# EasyEDA Pro project ProPrj_4进4出_2026-07-01.epro, schematic Schematic1

## Sheets
1 P1: Assembly Variant: Basic; Board Name: Board1; Create Date: 2026-05-13; Page Name: P1; Project Name: 4进4出; Schematic Name: Schematic1; Update Date: 2026-05-13; Company: 嘉立创EDA; Page Size: A4; Version: V1.0
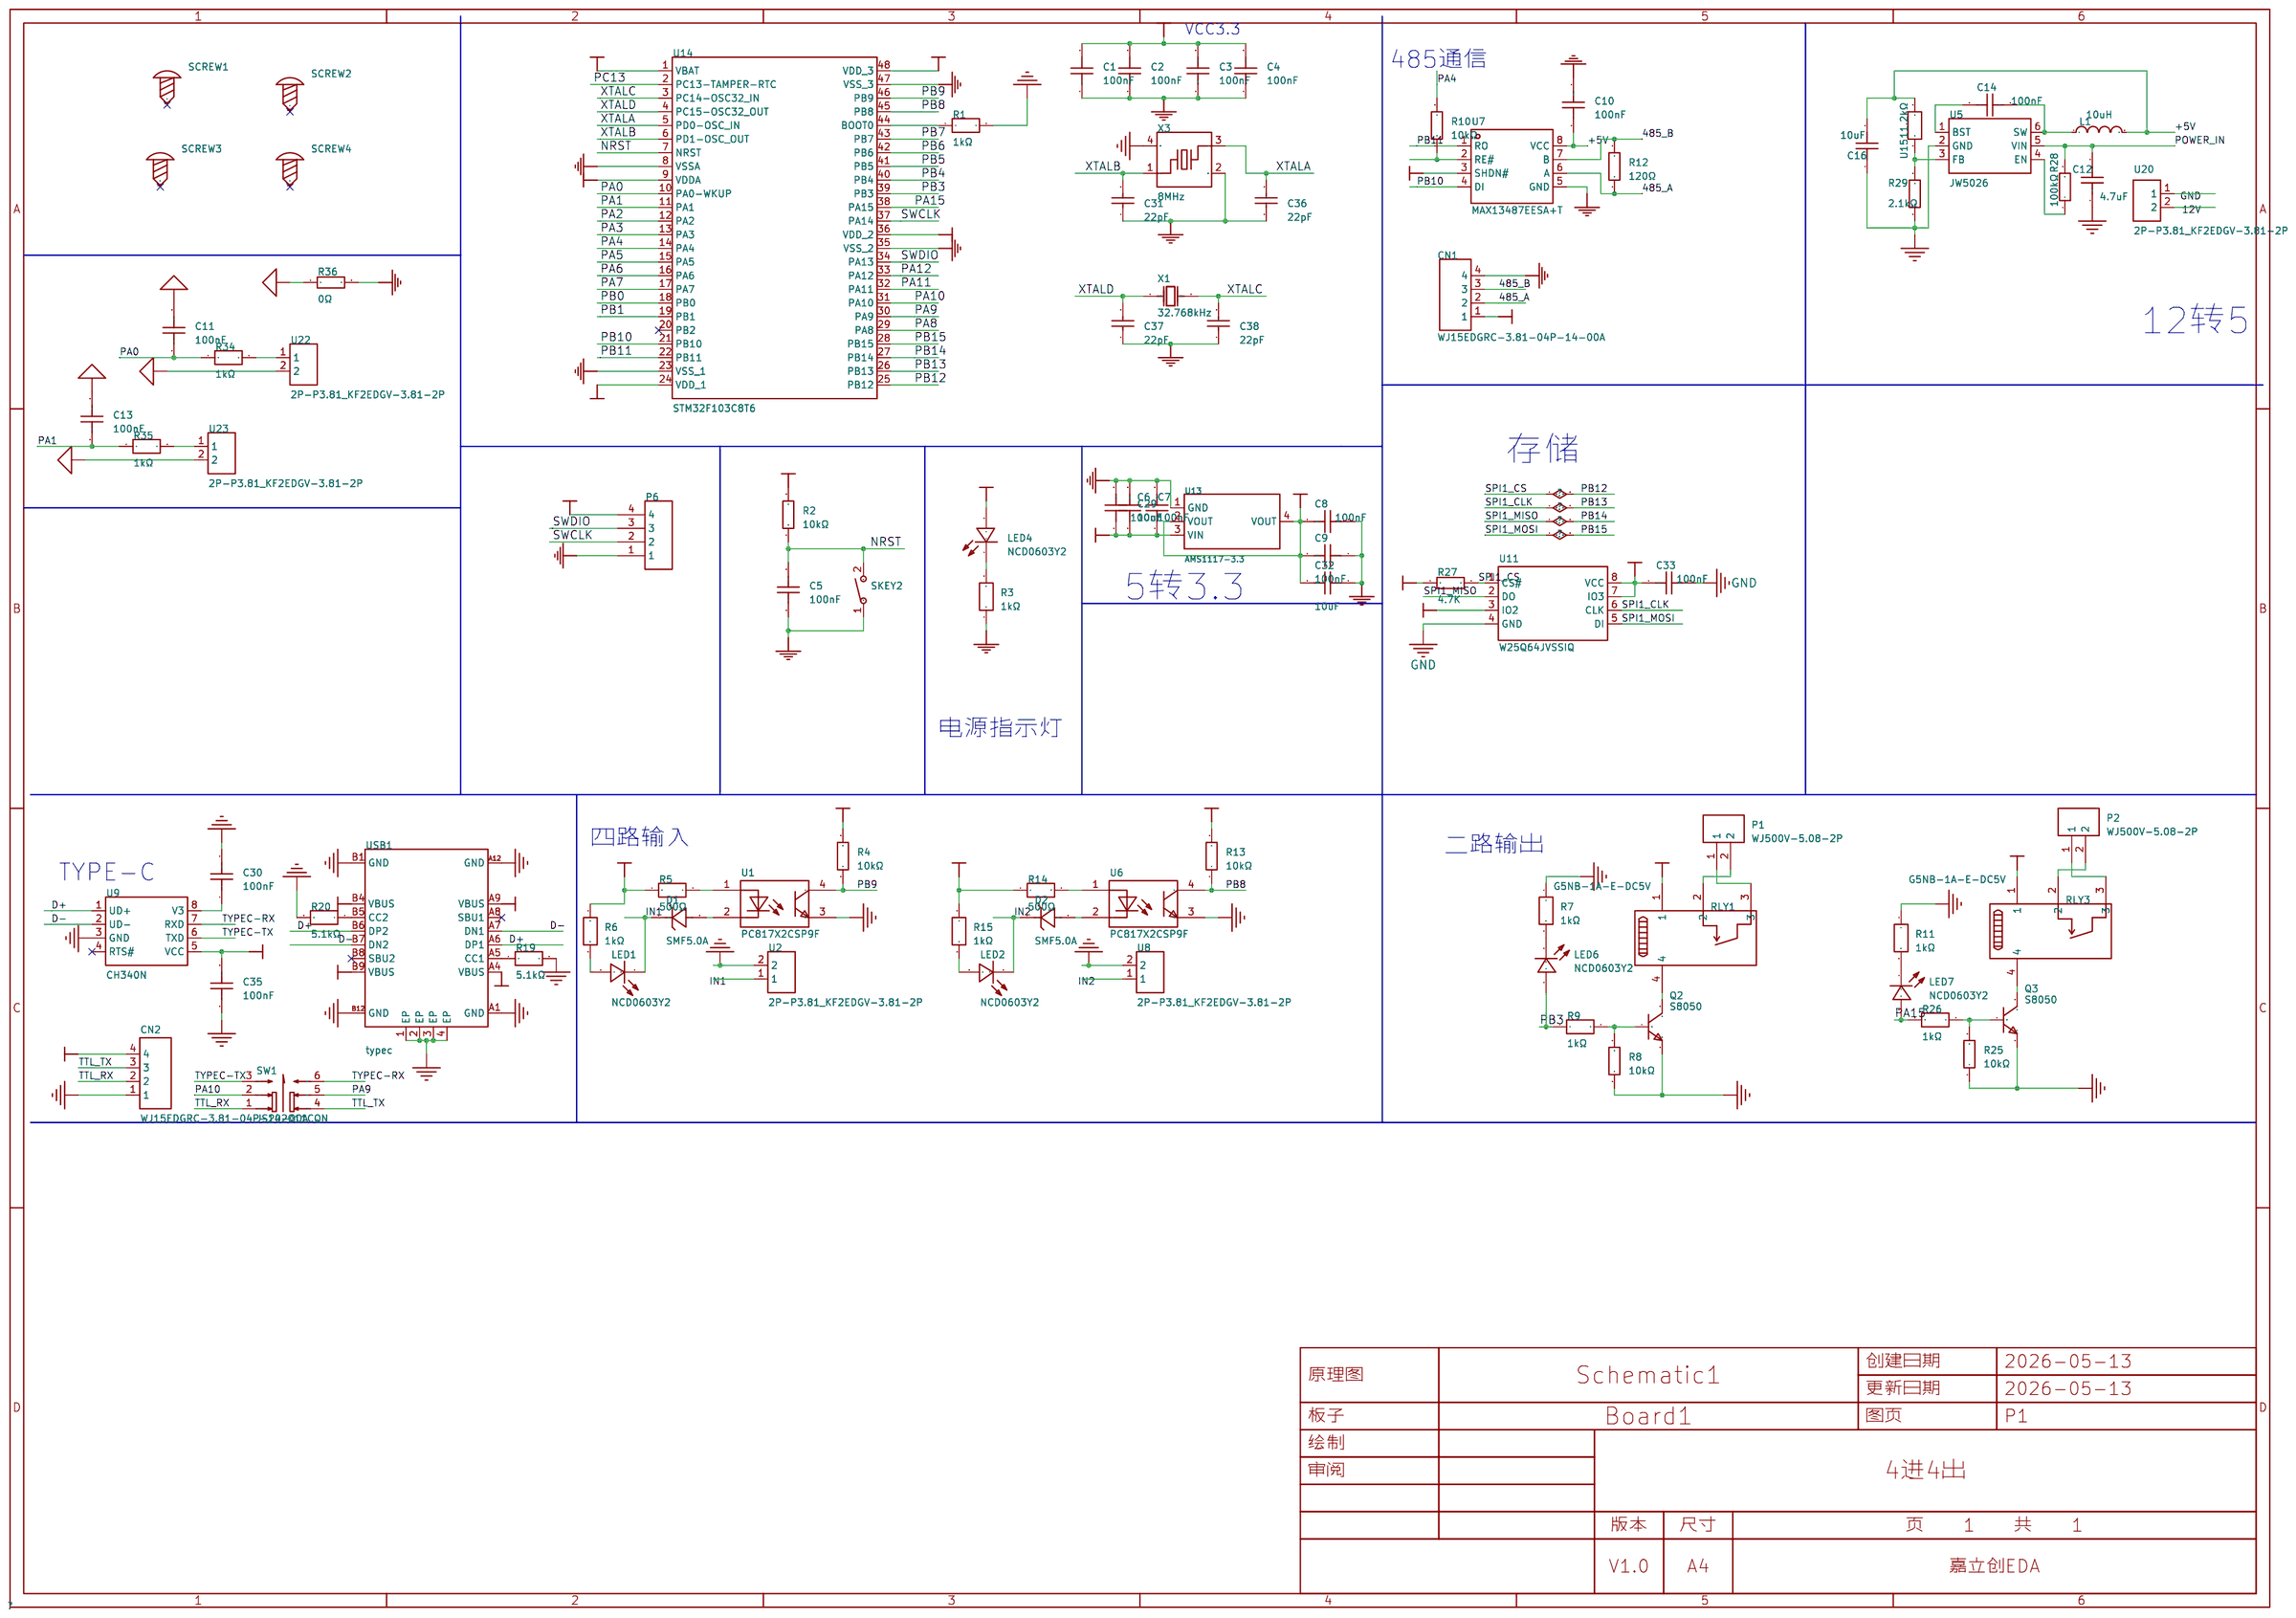
[diagram p0: P1]
2 W5500: Create Date: 2026-06-04; Page Name: P2; Update Date: 2026-06-04
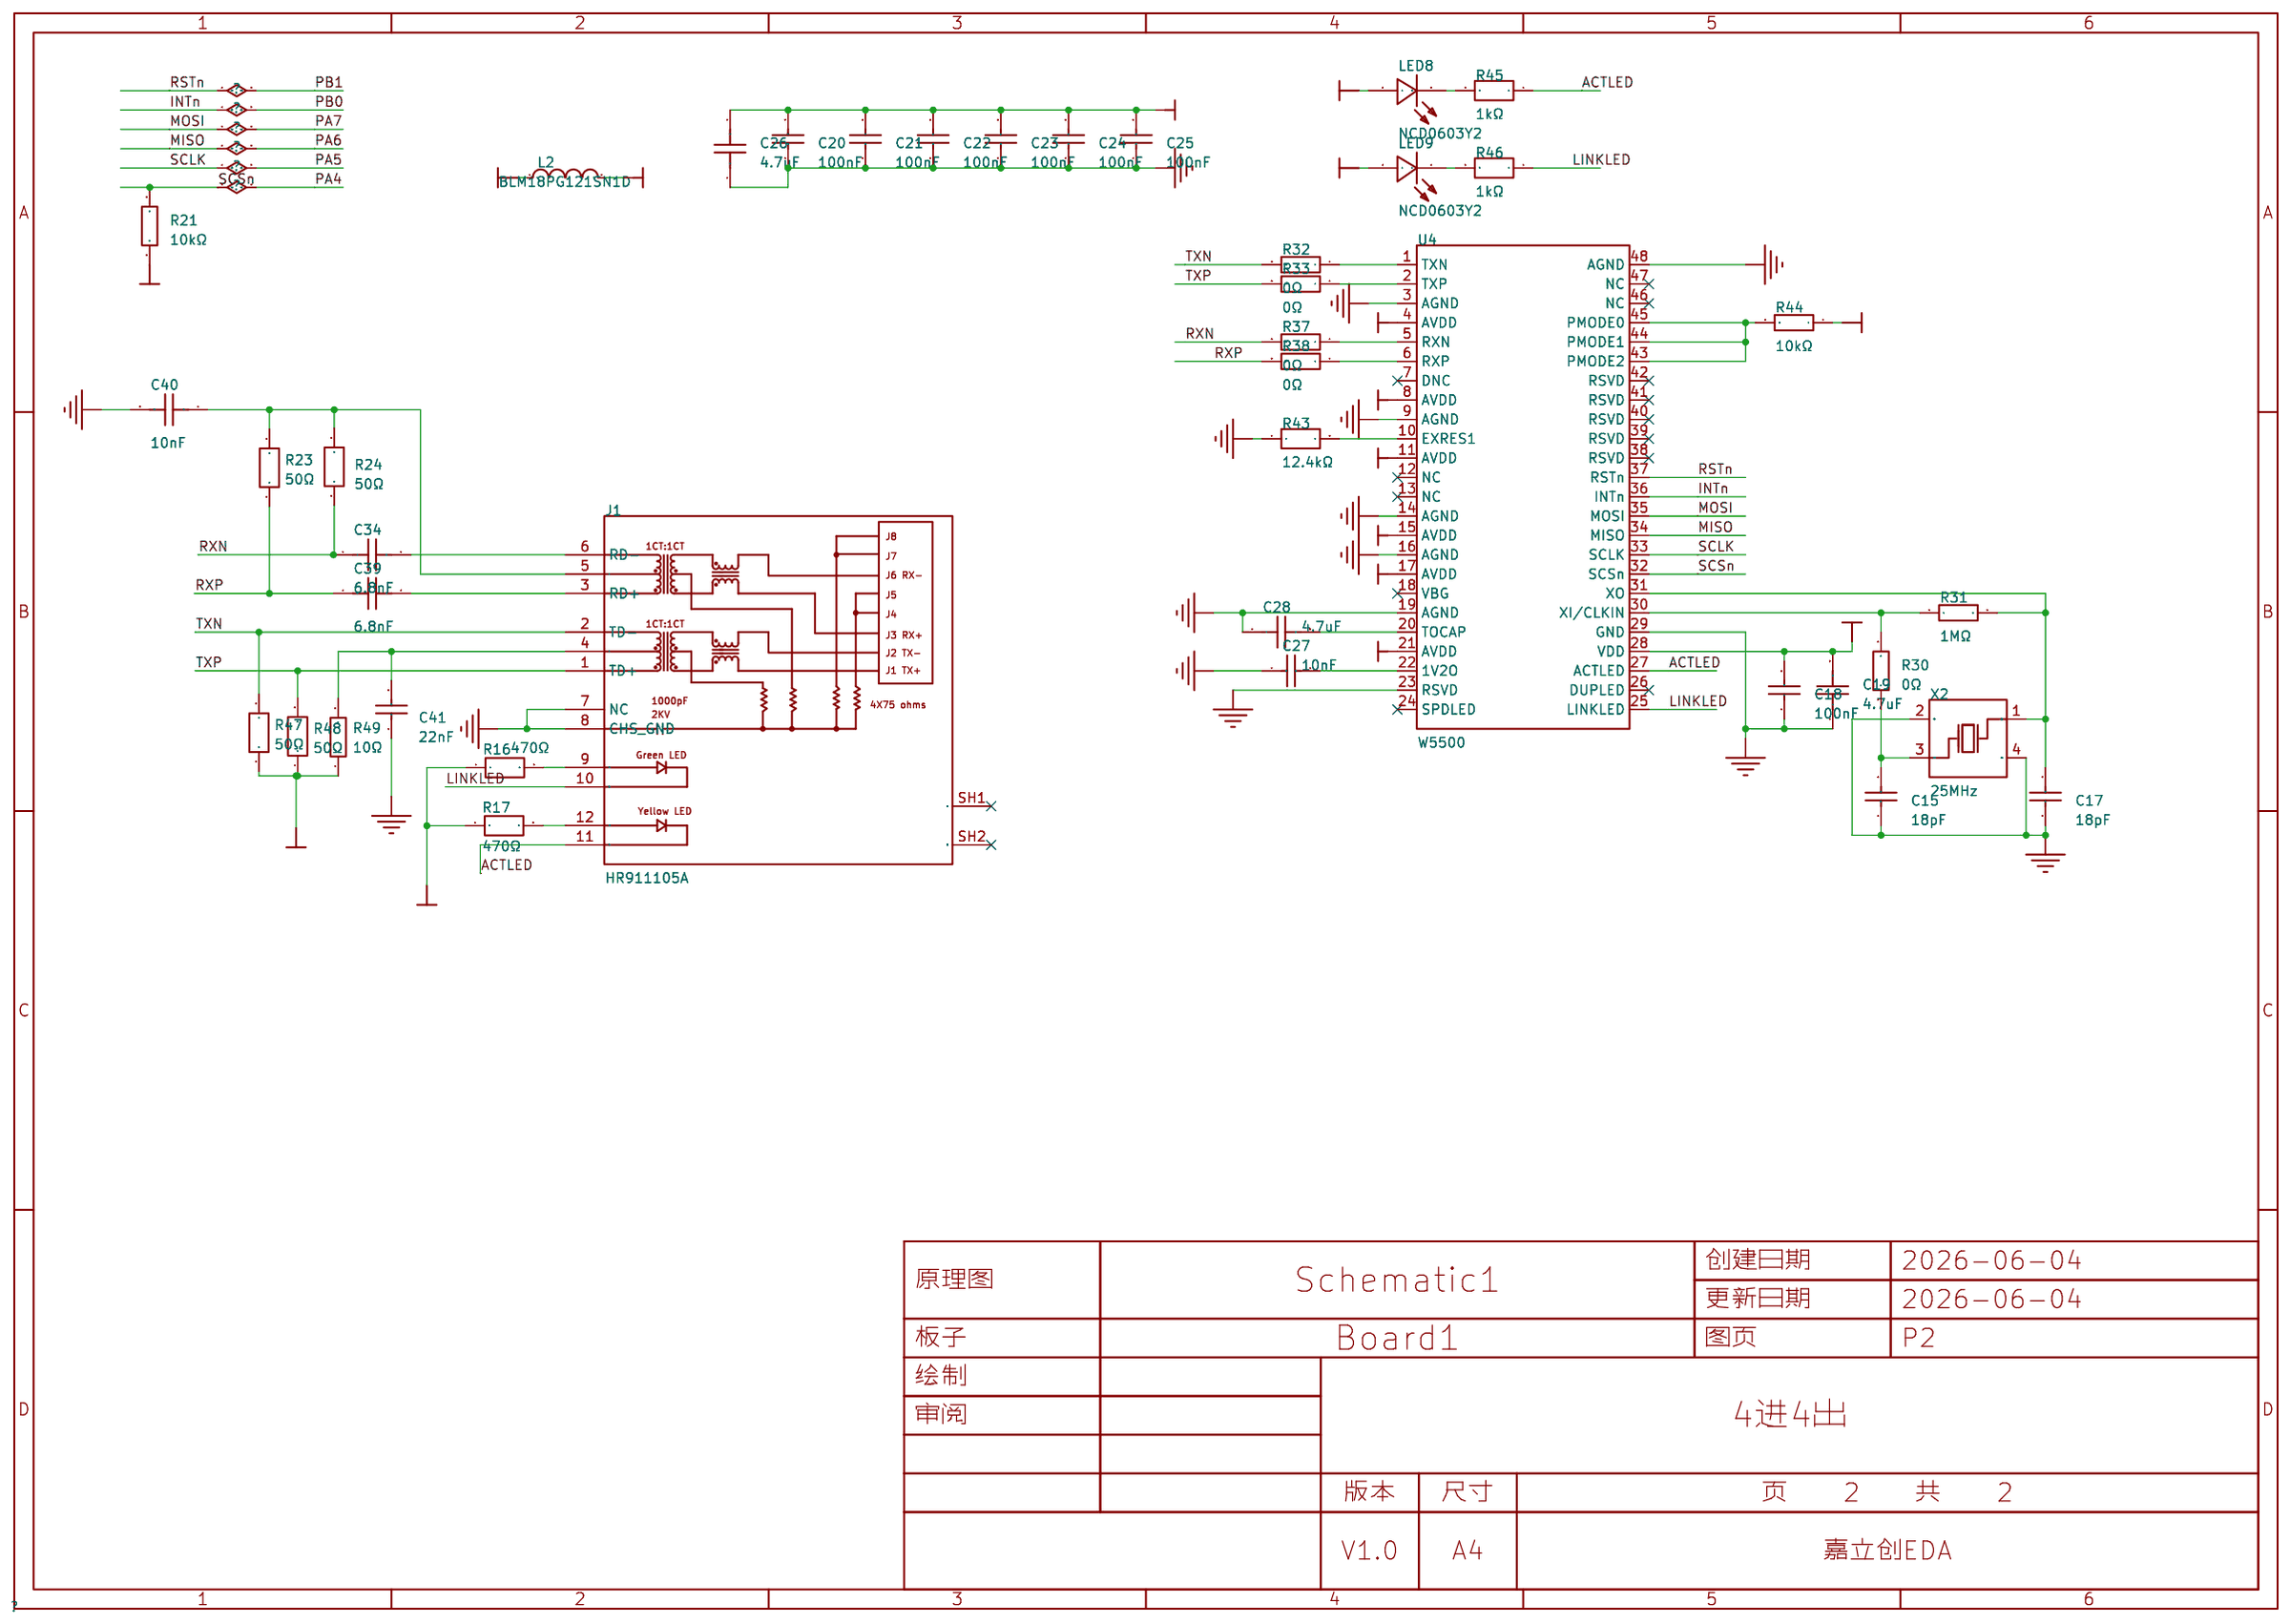
[diagram p1: W5500]
3 IIC: Create Date: 2026-06-18; Page Name: P2; Update Date: 2026-06-18
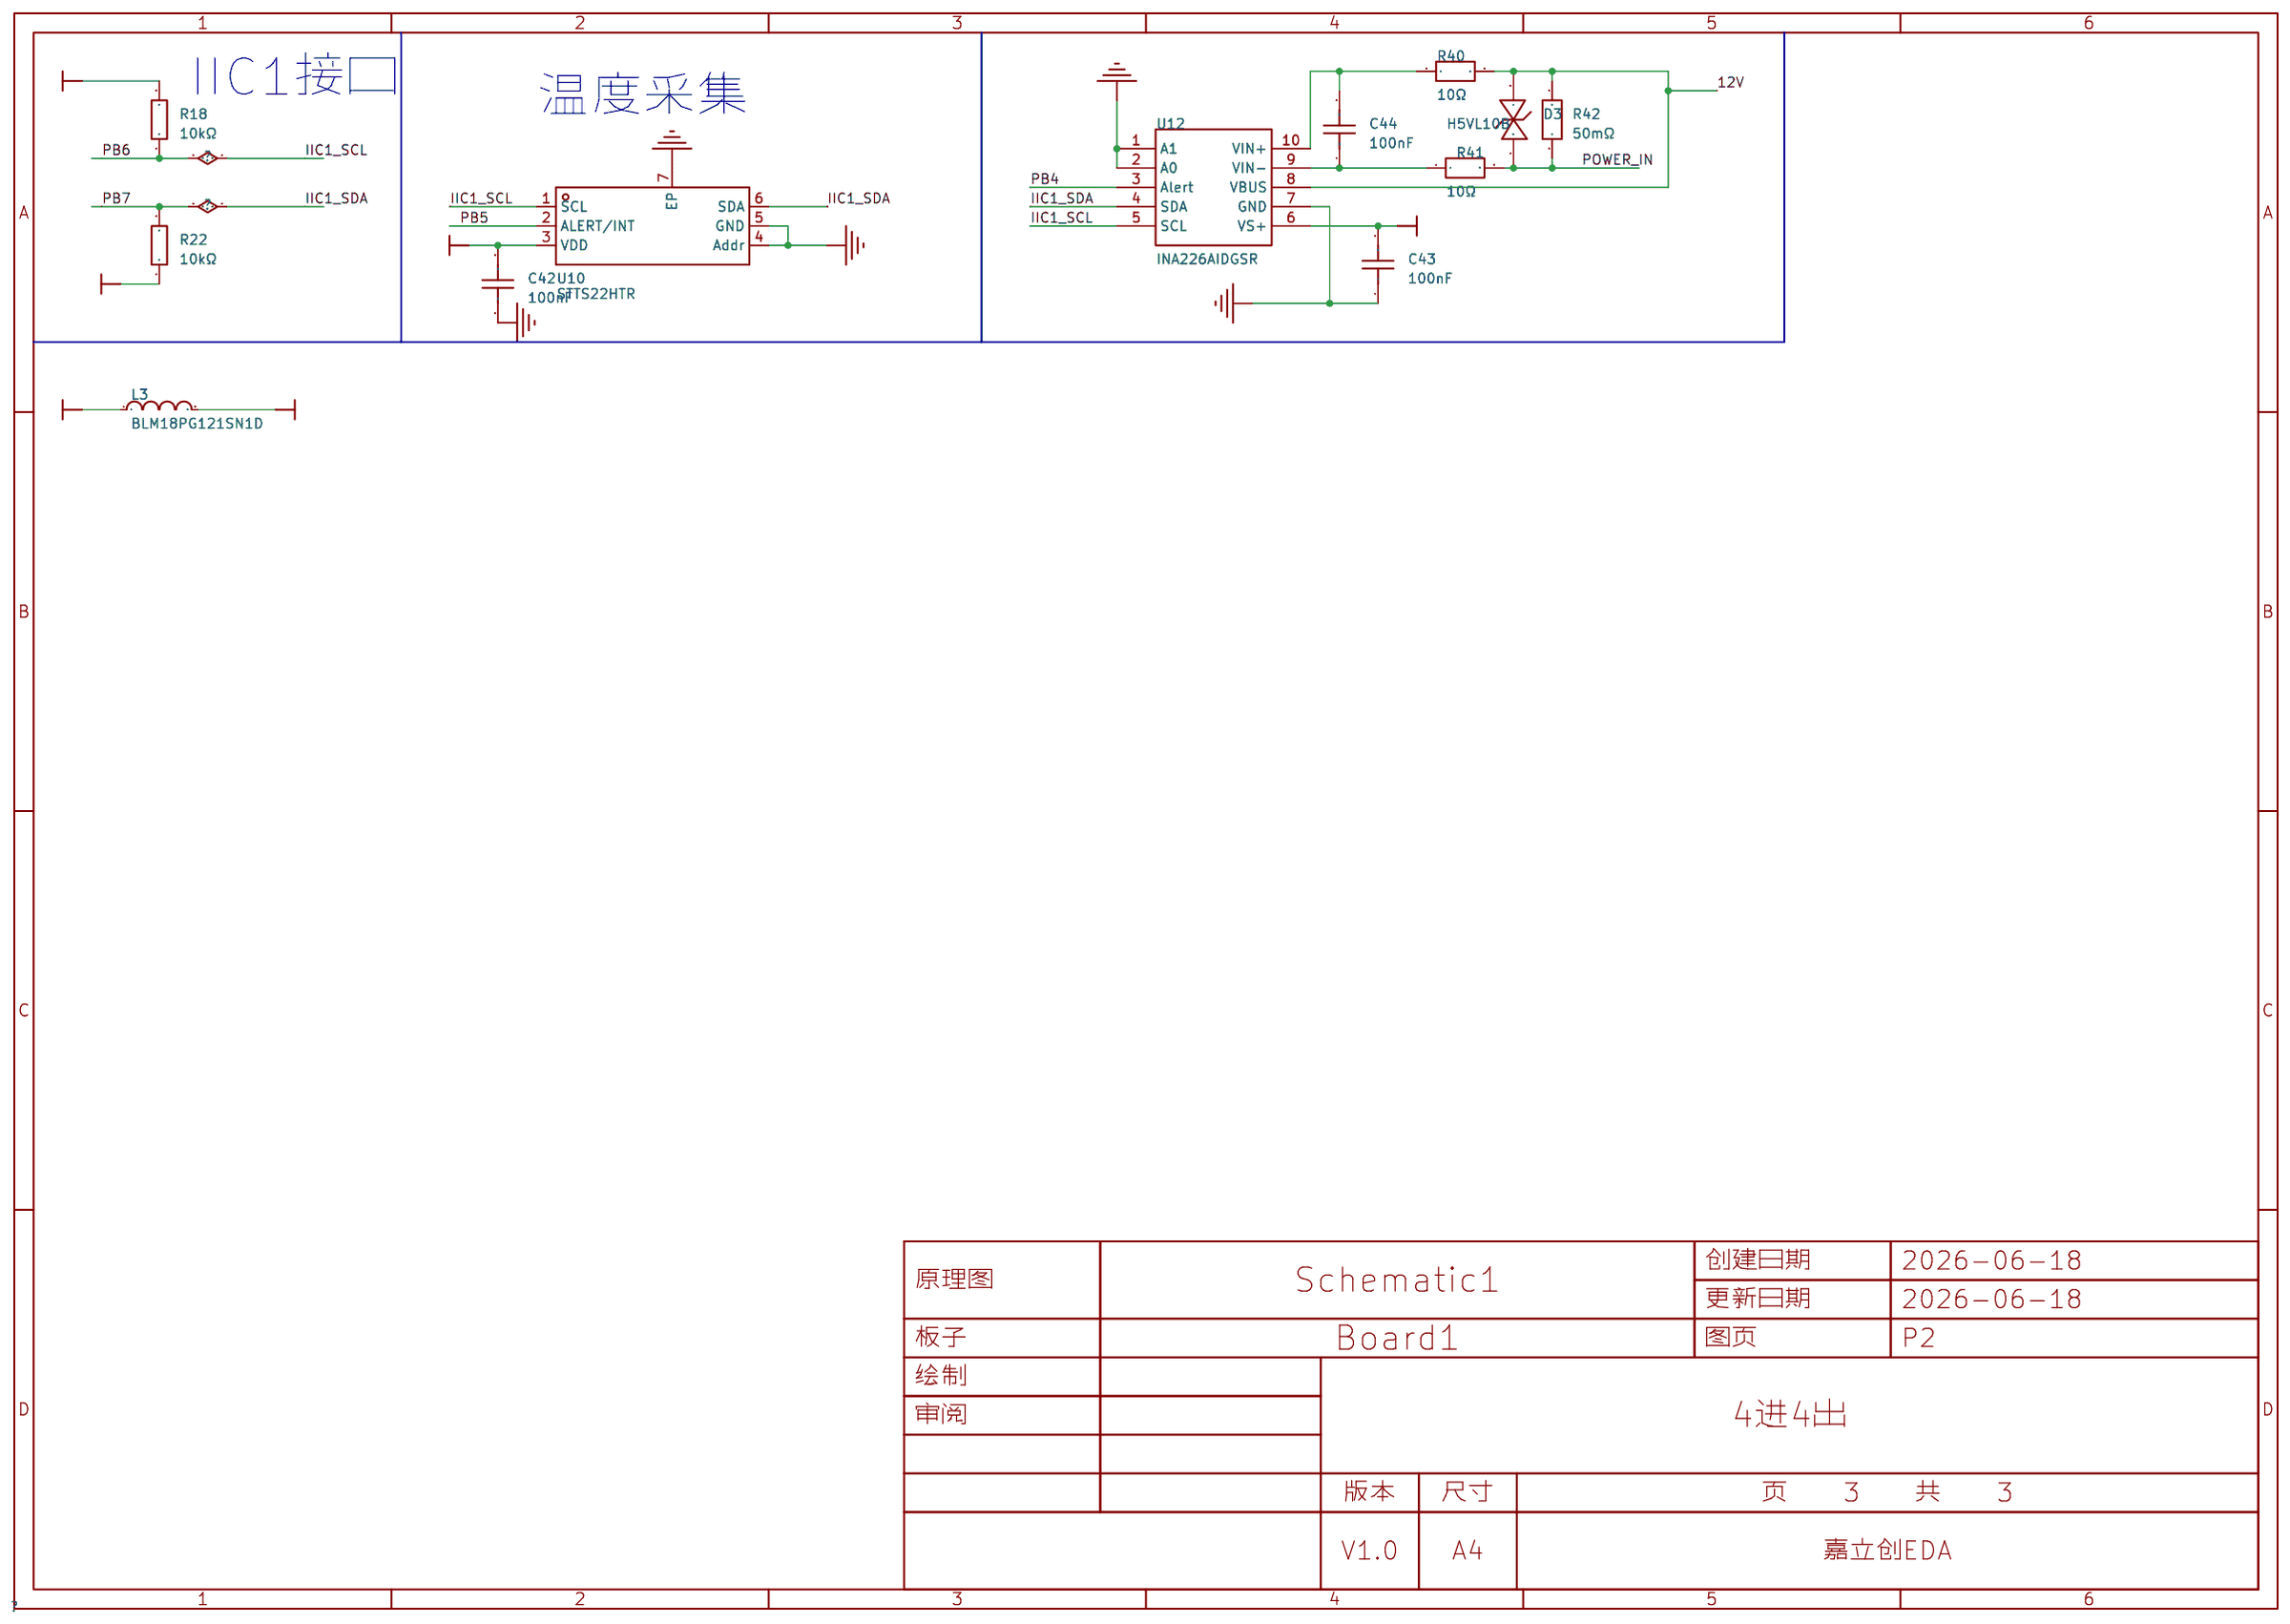
[diagram p2: IIC]

## Parts
sheet IIC
C42  100nF  [C0603]
C43  100nF  [C0603]
C44  100nF  [C0603]
D3  H5VL10B  [SOD-882_L1.0-W0.6-BI]
L3  BLM18PG121SN1D  [L0603]
R18  10kΩ  [R0603]
R22  10kΩ  [R0603]
R40  10Ω  [R0603]
R41  10Ω  [R0603]
R42  50mΩ  [R0603]
U10  STTS22HTR  [DFN-6_L2.0-W2.0-P0.65-BL-EP1.2]
U12  INA226AIDGSR  [MSOP-10_L3.0-W3.0-P0.50-LS5.0-BL]
sheet P1
C1  100nF  [C0603]
C2  100nF  [C0603]
C3  100nF  [C0603]
C4  100nF  [C0603]
C5  100nF  [C0603]
C6  100nF  [C0603]
C7  100nF  [C0603]
C8  100nF  [C0603]
C9  100nF  [C0603]
C10  100nF  [C0603]
C11  100nF  [C0603]
C12  4.7uF  [C0603]
C13  100nF  [C0603]
C14  100nF  [C0603]
C16  10uF  [C0603]
C29  10uF  [C0603]
C30  100nF  [C0603]
C31  22pF  [C0603]
C32  10uF  [C0603]
C33  100nF  [C0603]
C35  100nF  [C0603]
C36  22pF  [C0603]
C37  22pF  [C0603]
C38  22pF  [C0603]
CN1  WJ15EDGRC-3.81-04P-14-00A  [CONN-TH_WJ15EDGRC-3.81-4P]
CN2  WJ15EDGRC-3.81-04P-14-00A  [CONN-TH_WJ15EDGRC-3.81-4P]
D1  SMF5.0A  [SOD-123FL_L2.7-W1.8-LS3.8-RD]
D2  SMF5.0A  [SOD-123FL_L2.7-W1.8-LS3.8-RD]
L1  10uH  [IND-SMD_L7.3-W6.8]
LED1  NCD0603Y2  [LED0603-RD]
LED2  NCD0603Y2  [LED0603-RD]
LED4  NCD0603Y2  [LED0603-RD]
LED6  NCD0603Y2  [LED0603-RD]
LED7  NCD0603Y2  [LED0603-RD]
P1  WJ500V-5.08-2P  [CONN-TH_2P-P5.00_WJ500V-5.08-2P]
P2  WJ500V-5.08-2P  [CONN-TH_2P-P5.00_WJ500V-5.08-2P]
P6  4Pin  [4Pin-2.54]
Q2  S8050  [SOT-23-3_L2.9-W1.3-P1.90-LS2.3-BR]
Q3  S8050  [SOT-23-3_L2.9-W1.3-P1.90-LS2.3-BR]
R1  1kΩ  [R0603]
R2  10kΩ  [R0603]
R3  1kΩ  [R0603]
R4  10kΩ  [R0603]
R5  500Ω  [R0603]
R6  1kΩ  [R0603]
R7  1kΩ  [R0603]
R8  10kΩ  [R0603]
R9  1kΩ  [R0603]
R10  10kΩ  [R0603]
R11  1kΩ  [R0603]
R12  120Ω  [R0603]
R13  10kΩ  [R0603]
R14  500Ω  [R0603]
R15  1kΩ  [R0603]
R19  5.1kΩ  [R0603]
R20  5.1kΩ  [R0603]
R25  10kΩ  [R0603]
R26  1kΩ  [R0603]
R27  4.7K  [R0603_1]
R28  100kΩ  [R0603]
R29  2.1kΩ  [R0603]
R34  1kΩ  [R0603]
R35  1kΩ  [R0603]
R36  0Ω  [R0603]
RLY1  G5NB-1A-E-DC5V  [RELAY-TH_G5NB-1A-E-DCXX]
RLY3  G5NB-1A-E-DC5V  [RELAY-TH_G5NB-1A-E-DCXX]
SCREW1  -  [M2螺丝]
SCREW2  -  [M2螺丝]
SCREW3  -  [M2螺丝]
SCREW4  -  [M2螺丝]
SKEY2  TS-1185-B-A-B-A  [SW-SMD_L4.0-W3.0-LS5.0]
SW1  JS202011CQN  [SW-TH_JS202011CQN]
U1  PC817X2CSP9F  [SMD-4_L4.6-W6.5-P2.54-LS10.2-TL]
U2  2P-P3.81_KF2EDGV-3.81-2P  [CONN-TH_2P-P3.81_KF2EDGV-3.81-2P]
U5  JW5026  [SOT-23-6_L2.9-W1.6-P0.95-LS2.8-BR]
U6  PC817X2CSP9F  [SMD-4_L4.6-W6.5-P2.54-LS10.2-TL]
U7  MAX13487EESA+T  [SOIC-8_L4.9-W3.9-P1.27-LS6.0-BL]
U8  2P-P3.81_KF2EDGV-3.81-2P  [CONN-TH_2P-P3.81_KF2EDGV-3.81-2P]
U9  CH340N  [SOP-8_L4.9-W3.9-P1.27-LS6.0-BL]
U11  W25Q64JVSSIQ  [SOP-8_L5.3-W5.3-P1.27-LS8.0-BL]
U13  AMS1117-3.3  [SOT-223-3_L6.5-W3.4-P2.30-LS7.0-BR]
U14  STM32F103C8T6  [LQFP-48_L7.0-W7.0-P0.50-LS9.0-BL]
U15  11.2kΩ  [R0603]
U20  2P-P3.81_KF2EDGV-3.81-2P  [CONN-TH_2P-P3.81_KF2EDGV-3.81-2P]
U22  2P-P3.81_KF2EDGV-3.81-2P  [CONN-TH_2P-P3.81_KF2EDGV-3.81-2P]
U23  2P-P3.81_KF2EDGV-3.81-2P  [CONN-TH_2P-P3.81_KF2EDGV-3.81-2P]
USB1  typec  [USB-C-SMD_KH-TYPE-C-16P]
X1  32.768kHz  [CRYSTAL-SMD_L3.2-W1.5-1]
X3  8MHz  [CRYSTAL-SMD_4P-L3.2-W2.5-BL]
sheet W5500
C15  18pF  [C0603]
C17  18pF  [C0603]
C18  100nF  [C0603]
C19  4.7uF  [C0603]
C20  100nF  [C0603]
C21  100nF  [C0603]
C22  100nF  [C0603]
C23  100nF  [C0603]
C24  100nF  [C0603]
C25  100nF  [C0603]
C26  4.7uF  [C0603]
C27  10nF  [C0603]
C28  4.7uF  [C0603]
C34  6.8nF  [C0603]
C39  6.8nF  [C0603]
C40  10nF  [C0603]
C41  22nF  [C0603]
J1  HR911105A  [RJ45-TH_HR911105A]
L2  BLM18PG121SN1D  [L0603]
LED8  NCD0603Y2  [LED0603-RD]
LED9  NCD0603Y2  [LED0603-RD]
R16  470Ω  [R0603]
R17  470Ω  [R0603]
R21  10kΩ  [R0603]
R23  50Ω  [R0603]
R24  50Ω  [R0603]
R30  0Ω  [R0603]
R31  1MΩ  [R0603]
R32  0Ω  [R0603]
R33  0Ω  [R0603]
R37  0Ω  [R0603]
R38  0Ω  [R0603]
R43  12.4kΩ  [R0603]
R44  10kΩ  [R0603]
R45  1kΩ  [R0603]
R46  1kΩ  [R0603]
R47  50Ω  [R0603]
R48  50Ω  [R0603]
R49  10Ω  [R0603]
U4  W5500  [LQFP-48_L7.0-W7.0-P0.50-LS9.0-BL]
X2  25MHz  [CRYSTAL-SMD_4P-L3.2-W2.5-BL]

## Library data of the parts
C42-C44 = CL10B104KB8NNNC: 容值:100nF;精度:±10%;额定电压:50V;温度系数:X7R;; LCSC Part Name: 100nF ±10% 50V; Supplier Part: C1591; Manufacturer: SAMSUNG(三星); Supplier Footprint: 0603; JLCPCB Part Class: Extended Part; Datasheet: https://item.szlcsc.com/datasheet/CL10B104KB8NNNC/1943.html; Supplier: LCSC; Tolerance: ±10%; Voltage Rating: 50V; Temperature Coefficient: X7R
D3 = H5VL10B: 极性:双向;反向截止电压(Vrwm):5V;钳位电压:10V;峰值脉冲电流(Ipp):5A;峰值脉冲功率(Ppp):50W;击穿电压:5.6V;; LCSC Part Name: 丝印 PB 双向ESD 5V截止 峰值浪涌电流：5A; Supplier Part: C7420372; Manufacturer: R+O(宏嘉诚); Supplier Footprint: DFN1006-2L; JLCPCB Part Class: Extended Part; Datasheet: https://item.szlcsc.com/datasheet/H5VL10B/8397194.html; Supplier: LCSC; Polarity: 双向; Reverse Stand-Off Voltage (Vrwm): 5V; Clamping Voltage: 10V; Peak Pulse Current (Ipp): 5A; Peak Pulse Power Dissipation (Ppp): 50W; Voltage - Breakdown: 5.6V; Reverse Leakage Current (Ir): 100nA; Number of Channels: 单路; Operating Temperature: -55℃~+125℃; level of protection: IEC 61000-4-2；IEC 61000-4-5; Type: ESD; Junction Capacitance: 15pF
L2 L3 = BLM18PG121SN1D: 阻抗@频率:120Ω@100MHz;误差:±25%;直流电阻(DCR):50mΩ;; LCSC Part Name: 单路 0603磁珠 阻抗120Ω@100MHz; Supplier Part: C14709; Manufacturer: muRata(村田); Supplier Footprint: 0603; JLCPCB Part Class: Basic Part; Datasheet: https://item.szlcsc.com/datasheet/BLM18PG121SN1D/15379.html; Supplier: LCSC; Impedance @ Frequency: 120Ω@100MHz; Tolerance: ±25%; DC Resistance(DCR): 50mΩ; Current Rating: 2A; Number of Circuits: 1; Operating Temperature: -55℃~+125℃
R2 R4 R8 R10 R13 R18 R21 R22 R25 R44 = 0603WAF1002T5E: 电阻类型:厚膜电阻;阻值:10kΩ;精度:±1%;功率:100mW;最大工作电压:75V;温度系数:±100ppm/℃;; LCSC Part Name: 厚膜电阻 10kΩ ±1% 100mW; Supplier Part: C25804; Manufacturer: UNI-ROYAL(厚声); Supplier Footprint: 0603; JLCPCB Part Class: Basic Part; Datasheet: https://atta.szlcsc.com/upload/public/pdf/source/20200306/C422600_1E6D84923E4A46A82E41ADD87F860B5C.pdf; Supplier: LCSC; Type: 厚膜电阻; Tolerance: ±1%; Power(Watts): 100mW; Overload Voltage (Max): 75V; Temperature Coefficient: ±100ppm/℃; Operating Temperature Range: -55℃~+155℃
R40 R41 = FRC0603J100 TS: 电阻类型:厚膜电阻;阻值:10Ω;精度:±5%;功率:100mW;工作电压:75V;温度系数:±100ppm/℃;; LCSC Part Name: 10Ω ±5% 100mW 厚膜电阻; Supplier Part: C2907091; Manufacturer: FOJAN(富捷); Supplier Footprint: 0603; JLCPCB Part Class: Extended Part; Supplier: LCSC; Type: 厚膜电阻; Tolerance: ±5%; Power(Watts): 100mW; Voltage-Supply(Max): 75V; Temperature Coefficient: ±100ppm/℃; Operating Temperature: -55℃~+155℃
R42 = 0603WAJ050LT5E: 电阻类型:厚膜电阻;阻值:50mΩ;精度:±5%;功率:100mW;工作电压:75V;温度系数:±1000ppm/℃;; LCSC Part Name: 50mΩ ±5% 100mW 厚膜电阻; Supplier Part: C407485; Manufacturer: UNI-ROYAL(厚声); Supplier Footprint: 0603; JLCPCB Part Class: Extended Part; Datasheet: https://item.szlcsc.com/datasheet/0603WAJ050LT5E/396042.html; Supplier: LCSC; Type: 厚膜电阻; Tolerance: ±5%; Power(Watts): 100mW; Voltage-Supply(Max): 75V; Temperature Coefficient: ±1000ppm/℃; Operating Temperature: -55℃~+155℃
U10 = STTS22HTR: 精度为0.5°C的低压、超低功耗I2C/SMBus 3.0温度传感器; LCSC Part Name: 低电压 超低功率 温度传感器; Supplier Part: C2969838; Manufacturer: ST(意法半导体); Supplier Footprint: UDFN-6(2x2); JLCPCB Part Class: Extended Part; Datasheet: https://item.szlcsc.com/datasheet/STTS22HTR/3362302.html; Supplier: LCSC
U12 = INA226AIDGSR: 放大器数:-;共模电压:300mV~40V;增益:-;带宽:-;; LCSC Part Name: 高侧/低侧测量双向电流/功率监视器，具有I²C兼容接口; Supplier Part: C49851; Manufacturer: TI(德州仪器); Supplier Footprint: VSOP-10; JLCPCB Part Class: Extended Part; Datasheet: https://item.szlcsc.com/datasheet/INA226AIDGSR/50860.html; Supplier: LCSC; Vcm - Common Mode Voltage: 300mV~40V; Ib - Input Bias Current: 10nA; Vos - Input Offset Voltage: 2.5uV; Operating Temperature: -40℃~+125℃; Differential Voltage: ±40V; Single Supply: 2.7V~5.5V; Quiescent Current: 330uA; Input Offset Voltage Drift(Vos TC): 0.1uV/℃; Common Mode Rejection Ratio (CMRR): 140dB; Features: 可编程阈值告警；使能/关断功能；双向检测；数字输出接口；高边检测；低边检测；功率监控
C1-C11 C13 C14 C30 C33 C35 = CGA0603X7R104K500JT: 容值:100nF;精度:±10%;额定电压:50V;温度系数:X7R;; LCSC Part Name: 100nF ±10% 50V; Supplier Part: C6119867; Manufacturer: HRE(芯声); Supplier Footprint: 0603; JLCPCB Part Class: Extended Part; Datasheet: https://item.szlcsc.com/datasheet/CGA0603X7R104K500JT/7062573.html; Supplier: LCSC; Tolerance: ±10%; Voltage Rating: 50V; Temperature Coefficient: X7R
C12 C19 C26 C28 = CL10A475KO8NNNC: 容值:4.7uF;精度:±10%;额定电压:16V;温度系数:X5R;; LCSC Part Name: 4.7uF ±10% 16V; Supplier Part: C19666; Manufacturer: SAMSUNG(三星); Supplier Footprint: 0603; JLCPCB Part Class: Basic Part; Datasheet: https://item.szlcsc.com/datasheet/CL10A475KO8NNNC/20375.html; Supplier: LCSC; Tolerance: ±10%; Voltage Rating: 16V; Temperature Coefficient: X5R
C16 = CGA0603X5R106K100JT: 容值:10uF;精度:±10%;额定电压:10V;温度系数:X5R;; LCSC Part Name: 10uF ±10% 10V; Supplier Part: C6119842; Manufacturer: HRE(芯声); Supplier Footprint: 0603; JLCPCB Part Class: Extended Part; Datasheet: https://item.szlcsc.com/datasheet/CGA0603X5R106K100JT/7062548.html; Supplier: LCSC; Tolerance: ±10%; Voltage Rating: 10V; Temperature Coefficient: X5R
C29 C32 = CL10A106MA8NRNC: 容值:10uF;精度:±20%;额定电压:25V;温度系数:X5R;; LCSC Part Name: 10uF ±20% 25V; Supplier Part: C96446; Manufacturer: SAMSUNG(三星); Supplier Footprint: 0603; JLCPCB Part Class: Basic Part; Datasheet: https://item.szlcsc.com/datasheet/CL10A106MA8NRNC/97651.html; Supplier: LCSC; Tolerance: ±20%; Voltage Rating: 25V; Temperature Coefficient: X5R
C31 C36-C38 = CL10C220JB8NNNC: 容值:22pF;精度:±5%;额定电压:50V;温度系数:C0G;; LCSC Part Name: 22pF ±5% 50V; Supplier Part: C1653; Manufacturer: SAMSUNG(三星); Supplier Footprint: 0603; JLCPCB Part Class: Basic Part; Datasheet: https://item.szlcsc.com/datasheet/CL10C220JB8NNNC/2005.html; Supplier: LCSC; Tolerance: ±5%; Voltage Rating: 50V; Temperature Coefficient: C0G
CN1 CN2 = WJ15EDGRC-3.81-04P-14-00A: 连接器类型:板端/插座-闭口;固定方式:卡扣固定;结构:1x4P;间距:3.81mm;颜色:绿色;安装方式:弯插;排数:1;每排PIN数:4;额定电流:8A;额定电压:300V;线规 - AWG:-;线规 - 平方毫米:-;工作温度:-40℃~+105℃;; LCSC Part Name: 卡扣固定 1x4P 3.81mm 排数:1 每排P数:4; Supplier Part: C7245; Manufacturer: KANGNEX(康奈克斯电气); Supplier Footprint: 弯插,P=3.81mm; JLCPCB Part Class: Extended Part; Datasheet: https://item.szlcsc.com/datasheet/WJ15EDGRC-3.81-04P-14-00A/7720.html; Supplier: LCSC; Connector Type: 板端/插座-闭口; Termination Style: 卡扣固定; Number of Positions or Pins: 1x4P; Pitch: 3.81mm; Color: 绿色; Mounting Type: 弯插; Number of Pins: 4P; Number of Rows: 1; Number of PINs Per Row: 4; Current Rating: 8A; Voltage Rating (Max): 300V; Operating Temperature: -40℃~+105℃
D1 D2 = SMF5.0A_C19077497: 极性:单向;反向截止电压(Vrwm):5V;钳位电压:9.2V;峰值脉冲电流(Ipp):21.7A@10/1000us;峰值脉冲功率(Ppp):200W@10/1000us;击穿电压:7V;; LCSC Part Name: 单向TVS 5V截止 峰值浪涌电流：21.7A@10/1000us; Supplier Part: C19077497; Manufacturer: R+O(宏嘉诚); Supplier Footprint: SOD-123FL; JLCPCB Part Class: Extended Part; Datasheet: https://item.szlcsc.com/datasheet/SMF5.0A/20275582.html; Supplier: LCSC; Polarity: 单向; Reverse Stand-Off Voltage (Vrwm): 5V; Clamping Voltage: 9.2V; Peak Pulse Current (Ipp): 21.7A@10/1000us; Peak Pulse Power Dissipation (Ppp): 200W@10/1000us; Voltage - Breakdown: 7V; Reverse Leakage Current (Ir): 400uA; Number of Channels: 单路; Operating Temperature: -55℃~+150℃; level of protection: IEC 61000-4-2; Type: TVS
L1 = FXL0630-100-M: 电感值:10uH;精度:±20%;额定电流:4.5A;饱和电流(Isat):5.5A;类型:一体成型电感;; LCSC Part Name: 10uH ±20% 5.5A; Supplier Part: C167223; Manufacturer: cjiang(长江微电); Supplier Footprint: SMD,7x6.6mm; JLCPCB Part Class: Extended Part; Datasheet: https://item.szlcsc.com/datasheet/FXL0630-100-M/178606.html; Supplier: LCSC; Tolerance: ±20%; Current Rating: 4.5A; Current - Saturation(Isat): 5.5A; DC Resistance(DCR): 68mΩ; Type: 一体成型电感
LED1 LED2 LED4 LED6-LED9 = NCD0603Y2: 发光颜色:黄色;正向电压(VF):1.6V~2.6V;功率:65mW;正向电流:20mA;主波长:586nm~595nm;透镜颜色:无色透明透镜;发光强度:100mcd~220mcd;发光角度:130°;工作温度:-30℃~+85℃;; Supplier Part: C89811; Manufacturer: 国星光电; Supplier Footprint: 0603; JLCPCB Part Class: Extended Part; Datasheet: https://atta.szlcsc.com/upload/public/pdf/source/20200820/C89811_7FE84B429B6BCA3E113B125EE1452576.pdf; Supplier: LCSC; Emitted Color: 黄色; Forward Voltage (VF): 1.6V~2.6V; Power Dissipation: 65mW; Forward Current: 20mA; Dominant Wavelength: 586nm~595nm; Lens Color: 无色透明透镜; Luminous Intensity: 100mcd~220mcd; Viewing Angle: 130°; Operating Temperature: -30℃~+85℃
P1 P2 = WJ500V-5.08-2P: 结构:1x2P;间距:5.08mm;颜色:绿色;安装方式:直插;额定电流:18A;额定电压:250V;排数:1;线规 - AWG:14~30;线规 - 平方毫米:2.5;每排PIN数:2;触头材质:-;触头镀层:-;工作温度范围:-40℃~+105℃;焊接温度(最大值):-;; LCSC Part Name: 1x2P 5.08mm 直插 排数:1 每排P数:2; Supplier Part: C8465; Manufacturer: KANGNEX(康奈克斯电气); Supplier Footprint: 插件,P=5.08mm; JLCPCB Part Class: Extended Part; Datasheet: https://atta.szlcsc.com/upload/public/pdf/source/20191225/C8465_02D34CE5B5B4A53DF5891601D97FA9F4.pdf; Supplier: LCSC; Structure: 1x2P; Pitch: 5.08mm; Color: 绿色; Mounting Style: 直插; Current Rating (Max): 18A; Voltage Rating (Max): 250V; Number of Pins: 2P; Number of Rows: 1; Wire Gauge - AWG: 14~30; Wire Gauge - mm2: 2.5; Number of PINs Per Row: 2; Operating Temperature Range: -40℃~+105℃; Screw Specification: M2.5
P6 = 4Pin
Q2 Q3 = S8050_C20069125: 晶体管类型:NPN;集电极电流(Ic):500mA;集射极击穿电压(Vceo):25V;耗散功率(Pd):300mW;直流电流增益(hFE):120@50mA,1.0V;; LCSC Part Name: hFE:200-350，丝印:J3Y NPN 500mA 25V; Supplier Part: C20069125; Manufacturer: R+O(宏嘉诚); Supplier Footprint: SOT-23; JLCPCB Part Class: Extended Part; Datasheet: https://item.szlcsc.com/datasheet/S8050/21397163.html; Supplier: LCSC; type: NPN; Current - Collector(Ic): 500mA; Collector - Emitter Voltage VCEO: 25V; Pd - Power Dissipation: 300mW; DC Current Gain: 120@50mA,1.0V; Transition frequency(fT): 100MHz; Current - Collector Cutoff: 100nA; Vce Saturation(VCE(sat)): 600mV@500mA,50mA; Operating Temperature: -55℃~+150℃; Emitter-Base Voltage(Vebo): 5V
R1 R3 R5-R7 R9 R11 R14 R15 R26 R34 R35 R45 R46 = FRC0603F1001TS: 电阻类型:厚膜电阻;阻值:1kΩ;精度:±1%;功率:100mW;工作电压:75V;温度系数:±100ppm/℃;; LCSC Part Name: 1kΩ ±1% 100mW 厚膜电阻; Supplier Part: C2907002; Manufacturer: FOJAN(富捷); Supplier Footprint: 0603; JLCPCB Part Class: Extended Part; Supplier: LCSC; Type: 厚膜电阻; Tolerance: ±1%; Power(Watts): 100mW; Voltage-Supply(Max): 75V; Temperature Coefficient: ±100ppm/℃; Operating Temperature: -55℃~+155℃
R12 = 0603WAF1202T5E: 电阻类型:厚膜电阻;阻值:12kΩ;精度:±1%;功率:100mW;工作电压:75V;温度系数:±100ppm/℃;; LCSC Part Name: 12kΩ ±1% 100mW 厚膜电阻; Supplier Part: C22790; Manufacturer: UNI-ROYAL(厚声); Supplier Footprint: 0603; JLCPCB Part Class: Basic Part; Datasheet: https://item.szlcsc.com/datasheet/0603WAF1202T5E/23517.html; Supplier: LCSC; Type: 厚膜电阻; Tolerance: ±1%; Power(Watts): 100mW; Voltage-Supply(Max): 75V; Temperature Coefficient: ±100ppm/℃; Operating Temperature: -55℃~+155℃
R19 R20 = KTR03EZPF5101: 电阻类型:厚膜电阻;阻值:5.1kΩ;精度:±1%;功率:100mW;温度系数:±100ppm/℃;; LCSC Part Name: 厚膜电阻 5.1kΩ ±1% 100mW; Supplier Part: C4171024; Manufacturer: ROHM(罗姆); Supplier Footprint: 0603; JLCPCB Part Class: Extended Part; Datasheet: https://item.szlcsc.com/datasheet/KTR03EZPF5101/4741422.html; Supplier: LCSC; Type: 厚膜电阻; Tolerance: ±1%; Power(Watts): 100mW; Temperature Coefficient: ±100ppm/℃; Operating Temperature: -55℃~+155℃
R27 = 0603WAF3001T5E: 电阻类型:厚膜电阻;阻值:3kΩ;精度:±1%;功率:100mW;; LCSC Part Name: 3kΩ ±1% 100mW; Supplier Part: C4211; Manufacturer: UNI-ROYAL(厚声); Supplier Footprint: 0603; JLCPCB Part Class: 基础库; Datasheet: https://atta.szlcsc.com/upload/public/pdf/source/20200306/C422600_1E6D84923E4A46A82E41ADD87F860B5C.pdf; Supplier: LCSC; Type: 厚膜电阻; Tolerance: ±1%; Power(Watts): 100mW; Temperature Coefficient: ±100ppm/℃; Overload Voltage (Max): 75V; Operating Temperature Range: -55℃~+155℃
R28 = RC0603FR-07100KL: 电阻类型:厚膜电阻;阻值:100kΩ;精度:±1%;功率:100mW;最大工作电压:75V;温度系数:±100ppm/℃;; LCSC Part Name: 厚膜电阻 100kΩ ±1% 100mW; Supplier Part: C14675; Manufacturer: YAGEO(国巨); Supplier Footprint: 0603; JLCPCB Part Class: Extended Part; Datasheet: https://atta.szlcsc.com/upload/public/pdf/source/20140324/1457707028752.pdf; Supplier: LCSC; Type: 厚膜电阻; Tolerance: ±1%; Power(Watts): 100mW; Overload Voltage (Max): 75V; Temperature Coefficient: ±100ppm/℃; Operating Temperature Range: -55℃~+155℃
R29 = 0603WAF2101T5E: 电阻类型:厚膜电阻;阻值:2.1kΩ;精度:±1%;功率:100mW;工作电压:75V;温度系数:±100ppm/℃;; LCSC Part Name: 2.1kΩ ±1% 100mW 厚膜电阻; Supplier Part: C22902; Manufacturer: UNI-ROYAL(厚声); Supplier Footprint: 0603; JLCPCB Part Class: Extended Part; Datasheet: https://item.szlcsc.com/datasheet/0603WAF2101T5E/23629.html; Supplier: LCSC; Type: 厚膜电阻; Tolerance: ±1%; Power(Watts): 100mW; Voltage-Supply(Max): 75V; Temperature Coefficient: ±100ppm/℃; Operating Temperature: -55℃~+155℃
R36 = RC0603FR-070RL: 电阻类型:厚膜电阻;阻值:0Ω;精度:±1%;功率:100mW;工作电压:75V;温度系数:-;; LCSC Part Name: 厚膜电阻 0Ω ±1% 100mW; Supplier Part: C100044; Manufacturer: YAGEO(国巨); Supplier Footprint: 0603; JLCPCB Part Class: Extended Part; Datasheet: https://item.szlcsc.com/datasheet/RC0603FR-070RL/101258.html; Supplier: LCSC; Type: 厚膜电阻; Tolerance: ±1%; Power(Watts): 100mW; Voltage-Supply(Max): 75V; Operating Temperature: -55℃~+155℃
RLY1 RLY3 = G5NB-1A-E-DC5V: 线圈电压:5V;触点形式:一组常开:1A(单刀单掷-常开);触点容量(电阻负载):5A@250VAC；7A@250VAC；5A@30VDC;最大切换电压:-;最大切换电流:-;; LCSC Part Name: 5V 一组常开:1A(单刀单掷-常开); Supplier Part: C48746; Manufacturer: OMRON(欧姆龙); Supplier Footprint: 插件,20.4x7mm; JLCPCB Part Class: Extended Part; Datasheet: https://item.szlcsc.com/datasheet/G5NB-1A-E-DC5V/49754.html; Supplier: LCSC; Coil Voltage: 5V; Contact Form: 一组常开:1A(单刀单掷-常开); Contact Rating: 5A@250VAC；7A@250VAC；5A@30VDC; Coil Rated Power: 200mW; Contact Material: 银合金(无镉); Coil Resistance: 125Ω; Contact Resistance: 100mΩ; Operate Time: 10ms; Release Time: 10ms; Operating Temperature: -40℃~+85℃
SCREW1-SCREW4 = M2螺丝: Supplier Footprint: 插件
SKEY2 = TS-1185-B-A-B-A: 触点电流:50mA;额定电压(DC):12V;绝缘电阻:-;电路结构:单刀单掷;安装方式:立贴;带灯:无;作用力:160gf;机械寿命:10万次;带支架:否;; LCSC Part Name: 4*3*2mm 立贴 轻触开关; Supplier Part: C561517; Manufacturer: XKB Connectivity(中国星坤); Supplier Footprint: SMD; JLCPCB Part Class: 扩展库; Datasheet: https://atta.szlcsc.com/upload/public/pdf/source/20211011/C2F26DC0AE1820400F54DBF49644F5A1.pdf; Supplier: LCSC; Contact Current: 50mA; Voltage Rating (DC): 12V; Circuit: 单刀单掷; Mounting Style: 立贴; Actuator Style: 圆形按钮; Actuator/Cap Color: 黑色; With Lamp: 无; Operating Force: 160gf; Mechanical Life: 10万次; Operating Temperature: -30℃~+85℃; Switch Length: 4mm; Switch Width: 3mm; Switch Height: 2mm; Strike Gundam: 否
SW1 = JS202011CQN: 电路结构:双刀双掷;安装方式:直插;开关颜色:黑色;额定电流:300mA;额定电压:6V;工作寿命:5千次;; LCSC Part Name: 微型滑动开关; Supplier Part: C221663; Manufacturer: C&K; Supplier Footprint: 插件; JLCPCB Part Class: Extended Part; Datasheet: https://item.szlcsc.com/datasheet/JS202011CQN/222093.html; Supplier: LCSC; Circuit: 双刀双掷; Actuator Style: 矩形柱状; Termination Style: PC引脚; Length: 9mm; Width: 3.3mm; Switch Height: 5.5mm; Mounting Type: 直插; Actuator Color: 黑色; Current Rating: 300mA; Voltage Rating: 6V; Life: 5千次; Operating Temperature: -40℃~+85℃
U1 U6 = PC817X2CSP9F: 输入类型:DC;正向压降(Vf):1.2V;输出电流:50mA;隔离电压(Vrms):5kV;直流反向耐压(Vr):6V;负载电压:80V;输出通道数:-;集射极饱和电压(VCE(sat)):200mV@20mA,1mA;; LCSC Part Name: DC输入 隔离电压(rms):5000V; Supplier Part: C66405; Manufacturer: SHARP(夏普); Supplier Footprint: SMD-4P; JLCPCB Part Class: Extended Part; Datasheet: https://item.szlcsc.com/datasheet/PC817X2CSP9F/67489.html; Supplier: LCSC; Input type: DC; Output Type: 光电三极管; Voltage - Forward(Vf): 1.2V; Output Current: 50mA; Isolation Voltage(Vrms): 5kV; Reverse Voltage: 6V; Load Voltage: 80V; Vce Saturation(VCE(sat)): 200mV@20mA,1mA; Rise time: 4us; Fall time: 3us; Operating Temperature: -30℃~+100℃; Current Transfer Ratio (CTR) Minimum: 50%; Current Transfer Ratio (CTR) Maximum/Saturation Value: 600%; Total Power Dissipation(Pd): 200mW; Forward Current(If): 50mA
U2 U8 U20 U22 U23 = 2P-P3.81_KF2EDGV-3.81-2P: Supplier Part: C9900017459; JLCPCB Part Class: Extended Part; Supplier: LCSC
U5 = JW5026: 功能类型:降压型;工作电压:4.7V~40V;输出电压:800mV~37V;输出电流:1A;输出类型:可调;; LCSC Part Name: 40V/1A 1.1MHz 同步降压转换器; Supplier Part: C185109; Manufacturer: Joulwatt(杰华特); Supplier Footprint: SOT-23-6; JLCPCB Part Class: Extended Part; Datasheet: https://item.szlcsc.com/datasheet/JW5026/196514.html; Supplier: LCSC; Function: 降压型; Voltage - Supply: 4.7V~40V; Output Voltage: 800mV~37V; Output Current: 1A; Frequency - Switching: 750kHz~1.25MHz; Operating Temperature: -40℃~+125℃@(TJ); Synchronous Rectifier: 是; Number of Outputs: 1; Topology: 降压式; Quiescent Current: 40uA; Switch tube (built-in/external): 内置; Output Type: 可调
U7 = MAX13487EESA+T: 类型:收发器;数据速率:500Kbps;; LCSC Part Name: 半双工RS-485/RS-422兼容收发器，具有自动方向控制功能; Supplier Part: C18347; Manufacturer: ADI(亚德诺)/MAXIM(美信); Supplier Footprint: SOIC-8; JLCPCB Part Class: Extended Part; Datasheet: https://atta.szlcsc.com/upload/public/pdf/source/20130828/1457706641959.pdf; Supplier: LCSC; Types: 收发器; Number of Driver: 1; Number of receiver: 1; Supply Voltage: 4.75V~5.25V; Data Rate: 500Kbps; Operating Temperature: -40℃~+85℃
U9 = CH340N: 应用功能:USB转串口;USB协议版本:USB 2.0;通道数:1;数据速率:2Mbps;; LCSC Part Name: USB2.0芯片CH340; Supplier Part: C2977777; Manufacturer: WCH(南京沁恒); Supplier Footprint: SOP-8; JLCPCB Part Class: Extended Part; Datasheet: https://item.szlcsc.com/datasheet/CH340N/3390257.html; Supplier: LCSC; Applications Function: USB转串口; USB Protocol: USB 2.0; Number of Channels: 1; Voltage - Supply: 3.3V；5V; Data Rate: 2Mbps; Operating Temperature: -20℃~+70℃
U11 = W25Q64JVSSIQ_C83140: 接口类型:SPI;存储容量:64Mbit;时钟频率(fc):133MHz;; LCSC Part Name: 支持双线、四线SPI接口的3V 64Mbit 串行闪存; Supplier Part: C83140; Manufacturer: Winbond(华邦); Supplier Footprint: SOIC-8-208mil; JLCPCB Part Class: Extended Part; Datasheet: https://item.szlcsc.com/datasheet/W25Q64JVSSIQ/84304.html; Supplier: LCSC; Interface: SPI; Memory Size: 64Mbit; Clock Frequency: 133MHz; Voltage - Supply: 2.7V~3.6V; Standby Supply Current: 1uA; Program / Erase Cycles: 100000次; Page Programming Time (Tpp): 3ms; Data Retention - TDR (Year): 20年; Operating Temperature: -40℃~+85℃
U13 = AMS1117-3.3_C6186: 输出类型:固定;工作电压:16V;输出电压:3.3V;输出电流:1A;电源纹波抑制比(PSRR):72dB@(120Hz);输出极性:正极;; LCSC Part Name: 输出3.3V 1A; Supplier Part: C6186; Manufacturer: AMS; Supplier Footprint: SOT-223; JLCPCB Part Class: 基础库; Datasheet: https://atta.szlcsc.com/upload/public/pdf/source/20180727/C6186_7A095716F0823C02F1997A905E26C086.pdf; Supplier: LCSC; Output Type: 固定; Voltage - Supply: 16V; Output Voltage: 3.3V; Output Current: 1A; Power Supply Rejection Ratio (PSRR): 72dB@(120Hz); Voltage Dropout: 1.1V@(800mA); standby current: 5mA; Features: 过流保护；过热保护; Operating Temperature: -40℃~+125℃; Output Configuration: 正极; Number of Outputs: 1
U14 = STM32F103C8T6: CPU内核:ARM-M3;CPU最大主频:72MHz;应用领域:-;; LCSC Part Name: 主流增强型ARM Cortex-M3 MCU，具有64 KB Flash、72 MHz CPU、电机控制、USB和CAN; Supplier Part: C8734; Manufacturer: ST(意法半导体); Supplier Footprint: LQFP-48(7x7); JLCPCB Part Class: Extended Part; Datasheet: https://item.szlcsc.com/datasheet/STM32F103C8T6/9243.html; Supplier: LCSC; CPU Core: ARM-M3; CPU Maximum Speed: 72MHz; Program Storage Size: 64KB; Program Memory Type: FLASH; Number of I/O: 37; ADC (Bit): 12bit; Voltage - Supply: 2V~3.6V
U15 = 0603WAF1122T5E: 电阻类型:厚膜电阻;阻值:11.2kΩ;精度:±1%;功率:100mW;最大工作电压:75V;温度系数:±100ppm/℃;; LCSC Part Name: 11.2kΩ ±1% 100mW 厚膜电阻; Supplier Part: C2767146; Manufacturer: UNI-ROYAL(厚声); Supplier Footprint: 0603; JLCPCB Part Class: Extended Part; Datasheet: https://atta.szlcsc.com/upload/public/pdf/source/20200306/C422600_1E6D84923E4A46A82E41ADD87F860B5C.pdf; Supplier: LCSC; Type: 厚膜电阻; Tolerance: ±1%; Power(Watts): 100mW; Overload Voltage (Max): 75V; Temperature Coefficient: ±100ppm/℃; Operating Temperature Range: -55℃~+155℃
USB1 = typec: Supplier Part: C9900016956; Supplier Footprint: typec 12p; JLCPCB Part Class: Extended Part; Supplier: LCSC
X1 = XKXGI-SUA-32.768K: 晶振类型:贴片晶振;频率:32.768kHz;常温频差:±20ppm;负载电容:12.5pF;频率稳定度:±30ppm;; LCSC Part Name: YST310S 32.768KHZ 2P 3215 12.5PF ±20PPM -40~85℃; Supplier Part: C5213671; Manufacturer: YXC(扬兴晶振); Supplier Footprint: SMD3215-2P; JLCPCB Part Class: Extended Part; Datasheet: https://item.szlcsc.com/datasheet/XKXGI-SUA-32.768K/5908943.html; Supplier: LCSC; Type: 贴片晶振; Normal temperature Frequency Tolerance: ±20ppm; Load Capacitance: 12.5pF; Frequency Stability: ±30ppm; Operating Temperature: -40℃~+85℃
X3 = X32258MOB4SI: 晶振类型:贴片晶振;频率:8MHz;常温频差:±10ppm;负载电容:12pF;频率稳定度:±20ppm;; LCSC Part Name: YSX321SL 8MHZ 4P 3225 12PF ±10PPM -40~85℃ (±20PPM); Supplier Part: C2682775; Manufacturer: YXC(扬兴晶振); Supplier Footprint: SMD3225-4P; JLCPCB Part Class: Extended Part; Datasheet: https://item.szlcsc.com/datasheet/X32258MOB4SI/2777872.html; Supplier: LCSC; Type: 贴片晶振; Normal temperature Frequency Tolerance: ±10ppm; Load Capacitance: 12pF; Frequency Stability: ±20ppm; Equivalent Series Resistance(ESR): 150Ω; Operating Temperature: -40℃~+85℃
C15 C17 = CL10C180JB8NNNC: 容值:18pF;精度:±5%;额定电压:50V;温度系数:C0G;; LCSC Part Name: 18pF ±5% 50V; Supplier Part: C1647; Manufacturer: SAMSUNG(三星); Supplier Footprint: 0603; JLCPCB Part Class: Basic Part; Datasheet: https://item.szlcsc.com/datasheet/CL10C180JB8NNNC/1999.html; Supplier: LCSC; Tolerance: ±5%; Voltage Rating: 50V; Temperature Coefficient: C0G
C18 C20-C25 = CL10B104KA8NNNC: 容值:100nF;精度:±10%;额定电压:25V;温度系数:X7R;; LCSC Part Name: 100nF ±10% 25V; Supplier Part: C1590; Manufacturer: SAMSUNG(三星); Supplier Footprint: 0603; JLCPCB Part Class: Extended Part; Datasheet: https://item.szlcsc.com/datasheet/CL10B104KA8NNNC/1942.html; Supplier: LCSC; Tolerance: ±10%; Voltage Rating: 25V; Temperature Coefficient: X7R
C27 = CC0603KRX7R9BB103: 容值:10nF;精度:±10%;额定电压:50V;温度系数:X7R;; LCSC Part Name: 10nF ±10% 50V; Supplier Part: C100042; Manufacturer: YAGEO(国巨); Supplier Footprint: 0603; JLCPCB Part Class: Extended Part; Datasheet: https://item.szlcsc.com/datasheet/CC0603KRX7R9BB103/101256.html; Supplier: LCSC; Tolerance: ±10%; Voltage Rating: 50V; Temperature Coefficient: X7R
C34 C39 = C0603C682F4JACAUTO: 容值:6.8nF;精度:±1%;额定电压:16V;材质(温度系数):U2J;; LCSC Part Name: 6.8nF ±1% 16V; Supplier Part: C2318902; Manufacturer: KEMET(基美); Supplier Footprint: 0603; JLCPCB Part Class: Extended Part; Datasheet: https://atta.szlcsc.com/upload/public/pdf/source/20210401/C683AF8D88CB594B4CC57B8BC5EB7359.pdf; Supplier: LCSC; Tolerance: ±1%; Voltage Rated: 16V; Temperature Coefficient: U2J
C40 = GRM1885C1H103JA01D: 容值:10nF;精度:±5%;额定电压:50V;材质(温度系数):C0G;; LCSC Part Name: 10nF ±5% 50V; Supplier Part: C85973; Manufacturer: muRata(村田); Supplier Footprint: 0603; JLCPCB Part Class: Extended Part; Datasheet: https://atta.szlcsc.com/upload/public/pdf/source/20200305/C490387_23319AE8C154DEB24C505E6C82A8106A.pdf; Supplier: LCSC; Tolerance: ±5%; Voltage Rated: 50V; Temperature Coefficient: C0G
C41 = CL10B223KB8NNNC: 容值:22nF;精度:±10%;额定电压:50V;温度系数:X7R;; LCSC Part Name: 22nF ±10% 50V; Supplier Part: C21122; Manufacturer: SAMSUNG(三星); Supplier Footprint: 0603; JLCPCB Part Class: Basic Part; Datasheet: https://item.szlcsc.com/datasheet/CL10B223KB8NNNC/21834.html; Supplier: LCSC; Tolerance: ±10%; Voltage Rating: 50V; Temperature Coefficient: X7R
J1 = HR911105A_C12074: 连接器类型:RJ45插座;安装方式:弯插;端口数量:1;LED:带LED;屏蔽:有屏蔽;等级:-;触头材质:磷青铜;触头镀层:金;工作温度:0℃~+70℃;; LCSC Part Name: 弯插 带LED; Supplier Part: C12074; Manufacturer: HANRUN(汉仁); Supplier Footprint: 插件; JLCPCB Part Class: Extended Part; Datasheet: https://item.szlcsc.com/datasheet/HR911105A/12651.html; Supplier: LCSC; Connector Type: RJ45插座; Mounting Type: 弯插; Number of Ports: 1; LED: 带LED; Shielding: 有屏蔽; PoE: 不带PoE; Supplementary Features: 带滤波; Contact Material: 磷青铜; Contact Plating: 金; Operating Temperature: 0℃~+70℃
R16 R17 = FRC0603J471 TS: 电阻类型:厚膜电阻;阻值:470Ω;精度:±5%;功率:100mW;工作电压:75V;温度系数:±100ppm/℃;; LCSC Part Name: 470Ω ±5% 100mW 厚膜电阻; Supplier Part: C2907172; Manufacturer: FOJAN(富捷); Supplier Footprint: 0603; JLCPCB Part Class: Extended Part; Supplier: LCSC; Type: 厚膜电阻; Tolerance: ±5%; Power(Watts): 100mW; Voltage-Supply(Max): 75V; Temperature Coefficient: ±100ppm/℃; Operating Temperature: -55℃~+155℃
R23 R24 R47 R48 = FC0603E50R0BTBST1: 电阻类型:薄膜电阻;阻值:50Ω;精度:±0.1%;功率:125mW;工作电压:50V;温度系数:±25ppm/℃;; LCSC Part Name: 薄膜电阻 50Ω ±0.1% 125mW; Supplier Part: C1858411; Manufacturer: VISHAY(威世); Supplier Footprint: 0603; JLCPCB Part Class: Extended Part; Datasheet: https://item.szlcsc.com/datasheet/FC0603E50R0BTBST1/1949224.html; Supplier: LCSC; Type: 薄膜电阻; Tolerance: ±0.1%; Power(Watts): 125mW; Voltage-Supply(Max): 50V; Temperature Coefficient: ±25ppm/℃; Operating Temperature: -55℃~+155℃
R30 R32 R33 R37 R38 = 0603WAF0000T5E: 电阻类型:厚膜电阻;阻值:0Ω;精度:±1%;功率:100mW;工作电压:75V;温度系数:-;; LCSC Part Name: 0Ω ±1% 100mW 厚膜电阻; Supplier Part: C21189; Manufacturer: UNI-ROYAL(厚声); Supplier Footprint: 0603; JLCPCB Part Class: Basic Part; Datasheet: https://item.szlcsc.com/datasheet/0603WAF0000T5E/21903.html; Supplier: LCSC; Type: 厚膜电阻; Tolerance: ±1%; Power(Watts): 100mW; Voltage-Supply(Max): 75V; Operating Temperature: -55℃~+155℃
R31 = 0603WAF1004T5E: 电阻类型:厚膜电阻;阻值:1MΩ;精度:±1%;功率:100mW;工作电压:75V;温度系数:±100ppm/℃;; LCSC Part Name: 1MΩ ±1% 100mW 厚膜电阻; Supplier Part: C22935; Manufacturer: UNI-ROYAL(厚声); Supplier Footprint: 0603; JLCPCB Part Class: Basic Part; Datasheet: https://item.szlcsc.com/datasheet/0603WAF1004T5E/23662.html; Supplier: LCSC; Type: 厚膜电阻; Tolerance: ±1%; Power(Watts): 100mW; Voltage-Supply(Max): 75V; Temperature Coefficient: ±100ppm/℃; Operating Temperature: -55℃~+155℃
R43 = FRC0603F1242TS: 电阻类型:厚膜电阻;阻值:12.4kΩ;精度:±1%;功率:100mW;工作电压:75V;温度系数:±100ppm/℃;; LCSC Part Name: 12.4kΩ ±1% 100mW 厚膜电阻; Supplier Part: C2930060; Manufacturer: FOJAN(富捷); Supplier Footprint: 0603; JLCPCB Part Class: Extended Part; Supplier: LCSC; Type: 厚膜电阻; Tolerance: ±1%; Power(Watts): 100mW; Voltage-Supply(Max): 75V; Temperature Coefficient: ±100ppm/℃; Operating Temperature: -55℃~+155℃
R49 = RC0603FR-0710RL: 电阻类型:厚膜电阻;阻值:10Ω;精度:±1%;功率:100mW;最大工作电压:75V;温度系数:±200ppm/℃;; LCSC Part Name: 厚膜电阻 10Ω ±1% 100mW; Supplier Part: C109318; Manufacturer: YAGEO(国巨); Supplier Footprint: 0603; JLCPCB Part Class: Extended Part; Datasheet: https://atta.szlcsc.com/upload/public/pdf/source/20180316/70C0E2BDAE7FCC62C531A5A58D202EE1.pdf; Supplier: LCSC; Type: 厚膜电阻; Tolerance: ±1%; Power(Watts): 100mW; Overload Voltage (Max): 75V; Temperature Coefficient: ±200ppm/℃; Operating Temperature Range: -55℃~+155℃
U4 = W5500: W5500芯片是一款硬件化TCP/IP嵌入式以太网控制器，可让嵌入式系统更便捷地连接互联网。W5500将TCP/IP协议栈、10/100以太网MAC和PHY集成于单芯片中，用户只需使用该芯片，就能让其应用具备互联网连接能力。; LCSC Part Name: W5500硬连线TCP/IP嵌入式以太网控制器; Supplier Part: C32843; Manufacturer: WIZNET; Supplier Footprint: LQFP-48(7x7); JLCPCB Part Class: Extended Part; Datasheet: https://item.szlcsc.com/datasheet/W5500/33808.html; Supplier: LCSC; Number of Channels: 8; MAC Interface: SPI; Voltage - Supply: 3.3V; Integrated PHY: 是; Operating Temperature: -40℃~+85℃; Communication Interface: SPI; Memory Space: 32KB; Ethernet Speed Standards: 10BASE-T；100BASE-TX
X2 = X322525MOB4SI: 晶振类型:贴片晶振;频率:25MHz;常温频差:±10ppm;负载电容:12pF;频率稳定度:±20ppm;; LCSC Part Name: YSX321SL 25MHZ 4P 3225 12PF ±10PPM -40~85℃ (±20PPM); Supplier Part: C9006; Manufacturer: YXC(扬兴晶振); Supplier Footprint: SMD3225-4P; JLCPCB Part Class: Basic Part; Datasheet: https://item.szlcsc.com/datasheet/X322525MOB4SI/9526.html; Supplier: LCSC; Type: 贴片晶振; Normal temperature Frequency Tolerance: ±10ppm; Load Capacitance: 12pF; Frequency Stability: ±20ppm; Operating Temperature: -40℃~+85℃

## Nets
12V: D3.2(A) R40.2 R42.2 U12.8(VBUS) U20.2
+5V: C6.1 C7.1 C10.2 C16.2 C29.1 C35.2 CN1.1 CN2.4 L1.2 RLY1.1 RLY3.1 U7.8(VCC) U9.5(VCC) U13.3(VIN) U15.2 USB1.A4(VBUS) USB1.A9(VBUS) USB1.B4(VBUS) USB1.B9(VBUS)
AGND: C11.2 C13.2 R36.1 U22.2 U23.2
GND: C1.1 C2.1 C3.1 C4.1 C5.1 C6.2 C7.2 C8.1 C9.1 C10.1 C12.1 C15.1 C16.1 C17.1 C18.1 C19.1 C20.1 C21.1 C22.1 C23.1 C24.1 C25.1 C26.1 C27.1 C28.1 C29.2 C30.2 C31.1 C32.1 C33.2 C35.1 C36.1 C37.1 C38.1 C40.2 C41.1 C42.1 C43.1 CN1.4 CN2.1 J1.7(NC) J1.8(CHS GND) P6.1 Q2.2(E) Q3.2(E) R1.2 R3.1 R7.1 R8.1 R11.1 R19.2 R20.2 R25.1 R29.1 R36.2 R43.1 SKEY2.1 U1.3 U2.2 U4.3(AGND) U4.9(AGND) U4.14(AGND) U4.16(AGND) U4.19(AGND) U4.23(RSVD) U4.29(GND) U4.48(AGND) U5.2(GND) U6.3 U7.5(GND) U8.2 U9.3(GND) U10.4(Addr) U10.5(GND) U10.7(EP) U11.4(GND) U12.1(A1) U12.2(A0) U12.7(GND) U13.1(GND) U14.8(VSSA) U14.23(VSS_1) U14.35(VSS_2) U14.47(VSS_3) U20.1 USB1.1(EP) USB1.2(EP) USB1.3(EP) USB1.4(EP) USB1.A1(GND) USB1.A12(GND) USB1.B1(GND) USB1.B12(GND) X2.2(GND) X2.4(GND) X3.2(GND) X3.4(GND)
VCC3.3: C1.2 C2.2 C3.2 C4.2 C8.2 C9.2 C18.2 C19.2 C32.2 C33.1 L2.1 L3.1 LED4.2(A) LED8.2(A) LED9.2(A) P6.4 R2.2 R4.2 R5.1 R6.1 R13.2 R14.1 R15.1 R16.1 R17.1 R18.2 R21.2 R22.1 R27.1 R44.1 U4.28(VDD) U7.3(SHDN#) U11.3(IO2) U11.7(IO3) U11.8(VCC) U13.2(VOUT) U13.4(VOUT) U14.1(VBAT) U14.9(VDDA) U14.24(VDD_1) U14.36(VDD_2) U14.48(VDD_3)
3.3A: C20.2 C21.2 C22.2 C23.2 C24.2 C25.2 C26.2 L2.2 U4.4(AVDD) U4.8(AVDD) U4.11(AVDD) U4.15(AVDD) U4.17(AVDD) U4.21(AVDD)
485_A: CN1.2 R12.1 U7.6(A)
485_B: CN1.3 R12.2 U7.7(B)
ACTLED: J1.11 R45.1 U4.27(ACTLED)
D+: U9.1(UD+) USB1.A6(DP1) USB1.B6(DP2)
D-: U9.2(UD-) USB1.A7(DN1) USB1.B7(DN2)
IIC1_SCL: R18.1 U10.1(SCL) U12.5(SCL) U14.42(PB6)
IIC1_SDA: R22.2 U10.6(SDA) U12.4(SDA) U14.43(PB7)
IIC-A-3.3: C42.2 C43.2 L3.2 U10.3(VDD) U12.6(VS+)
IN1: D1.1(K) LED1.1(K) U2.1
IN2: D2.1(K) LED2.1(K) U8.1
INTn: U4.36(INTn) U14.18(PB0)
LINKLED: J1.10 R46.1 U4.25(LINKLED)
MISO: U4.34(MISO) U14.16(PA6)
MOSI: U4.35(MOSI) U14.17(PA7)
NRST: C5.2 R2.1 SKEY2.2 U14.7(NRST)
PA0: C11.1 R34.1 U14.10(PA0-WKUP)
PA1: C13.1 R35.1 U14.11(PA1)
PA2: U14.12(PA2)
PA3: U14.13(PA3)
PA4: R10.2 R21.1 U4.32(SCSn) U14.14(PA4)
PA5: U4.33(SCLK) U14.15(PA5)
PA8: U14.29(PA8)
PA9: SW1.5 U14.30(PA9)
PA10: SW1.2 U14.31(PA10)
PA11: U14.32(PA11)
PA12: U14.33(PA12)
PA15: LED7.2(A) R26.1 U14.38(PA15)
PB1: U4.37(RSTn) U14.19(PB1)
PB3: LED6.2(A) R9.1 U14.39(PB3)
PB4: U12.3(Alert) U14.40(PB4)
PB5: U10.2(ALERT/INT) U14.41(PB5)
PB8: R13.1 U6.4 U14.45(PB8)
PB9: R4.1 U1.4 U14.46(PB9)
PB10: U7.4(DI) U14.21(PB10)
PB11: U7.1(RO) U14.22(PB11)
PB12: R27.2 U11.1(CS#) U14.25(PB12)
PB13: U11.6(CLK) U14.26(PB13)
PB14: U11.2(DO) U14.27(PB14)
PB15: U11.5(DI) U14.28(PB15)
PC13: U14.2(PC13-TAMPER-RTC)
POWER_IN: C12.2 D3.1(C) R28.2 R41.2 R42.1 U5.5(VIN)
RXN: C34.1 R24.1 R37.2
RXP: C39.1 R23.1 R38.2
SWCLK: P6.2 U14.37(PA14)
SWDIO: P6.3 U14.34(PA13)
TTL_RX: CN2.2 SW1.1
TTL_TX: CN2.3 SW1.4
TXN: J1.2(TD-) R32.2 R47.2
TXP: J1.1(TD+) R33.2 R48.2
TYPEC-RX: SW1.6 U9.7(RXD)
TYPEC-TX: SW1.3 U9.6(TXD)
XTALA: C36.2 U14.5(PD0-OSC_IN) X3.3
XTALB: C31.2 U14.6(PD1-OSC_OUT) X3.1
XTALC: C38.2 U14.3(PC14-OSC32_IN) X1.2(OSC2)
XTALD: C37.2 U14.4(PC15-OSC32_OUT) X1.1(OSC1)
$1N367: R20.1 USB1.B5(CC2)
$1N370: R19.1 USB1.A5(CC1)
$1N388: C30.1 U9.8(V3)
$1N491: R1.1 U14.44(BOOT0)
$1N546: LED4.1(K) R3.2
$1N558: R5.2 U1.1
$1N561: LED1.2(A) R6.2
$1N563: D1.2(A) U1.2
$1N574: P1.2 RLY1.2
$1N576: Q2.1(B) R8.2 R9.2
$1N586: R10.1 U7.2(RE#)
$1N625: D2.2(A) U6.2
$1N627: LED2.2(A) R15.2
$1N628: R14.2 U6.1
$1N654: P1.1 RLY1.3
$1N655: P2.1 RLY3.3
$1N656: P2.2 RLY3.2
$1N658: Q3.1(B) R25.2 R26.2
$1N660: Q3.3(C) RLY3.4
$1N687: Q2.3(C) RLY1.4
$1N688: LED6.1(K) R7.2
$1N691: LED7.1(K) R11.2
$1N700: R34.2 U22.1
$1N708: R35.2 U23.1
$1N758: R29.2 U5.3(FB) U15.1
$1N759: C14.2 L1.1 U5.6(SW)
$1N760: C14.1 U5.1(BST)
$1N761: R28.1 U5.4(EN)
$2N2: R30.2 R31.1 U4.30(XI/CLKIN)
$2N7: C17.2 R31.2 U4.31(XO) X2.1(OSC1)
$2N11: C15.2 R30.1 X2.3(OSC2)
$2N23: R44.2 U4.43(PMODE2) U4.44(PMODE1) U4.45(PMODE0)
$2N27: R32.1 U4.1(TXN)
$2N28: R33.1 U4.2(TXP)
$2N29: R37.1 U4.5(RXN)
$2N30: R38.1 U4.6(RXP)
$2N48: R43.2 U4.10(EXRES1)
$2N51: C27.2 U4.22(1V2O)
$2N52: C28.2 U4.20(TOCAP)
$2N79: LED8.1(K) R45.2
$2N82: LED9.1(K) R46.2
$2N96: C34.2 J1.6(RD-)
$2N97: C39.2 J1.3(RD+)
$2N112: C41.2 J1.4 R49.2
$2N122: C40.1 J1.5 R23.2 R24.2
$3N26: C44.1 R41.1 U12.9(VIN-)
$3N27: C44.2 R40.1 U12.10(VIN+)
Net-(R47-1): R47.1 R48.1 R49.1

Not connected (* = marked no-connect by the designer): J1 9 12 SH1* SH2*; R16 2; R17 2; SCREW1 1*; SCREW2 1*; SCREW3 1*; SCREW4 1*; U4 7(DNC)* 12(NC)* 13(NC)* 18(VBG)* 24(SPDLED)* 26(DUPLED)* 38(RSVD)* 39(RSVD)* 40(RSVD)* 41(RSVD)* 42(RSVD)* 46(NC)* 47(NC)*; U9 4(RTS#)*; U14 20(PB2)*; USB1 A8(SBU1)* B8(SBU2)*

## Notes on the sheets
sheet 1
- VCC3.3
- 485通信
- 12转5
- 存储
- 5转3.3
- 电源指示灯
- 四路输入
- 二路输出
- TYPE-C
sheet 3
- IIC1接口
- 温度采集
